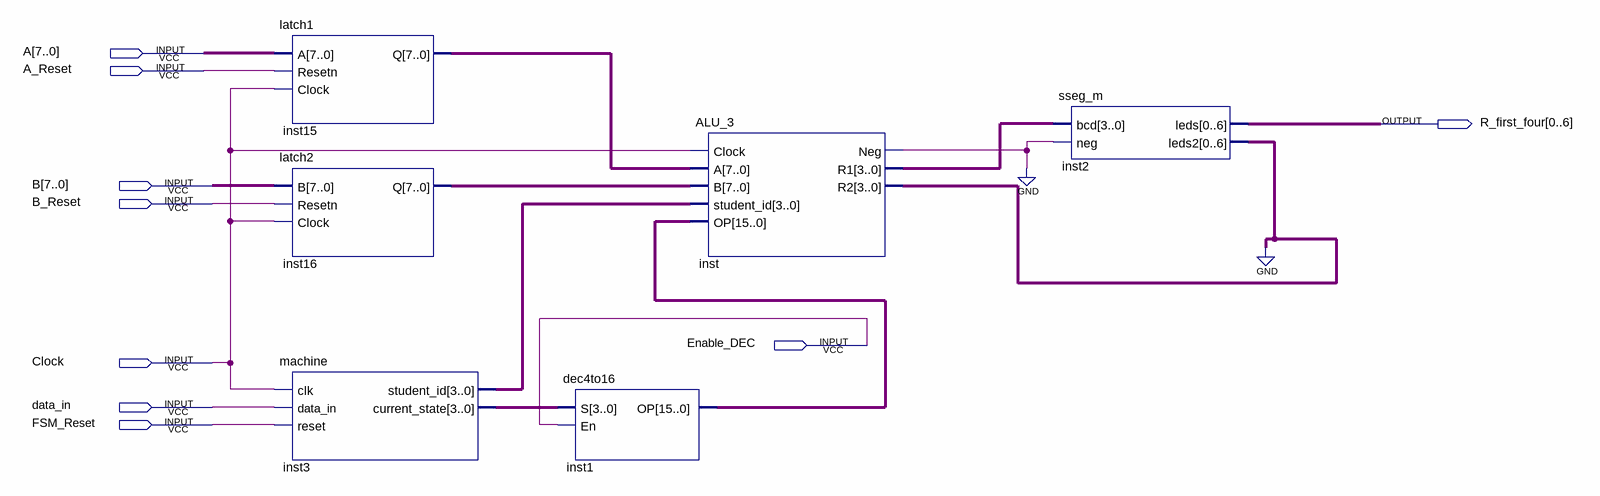
[diagram p0: schematic sheet]
// Quartus schematic alu_3gpu.bdf as structural Verilog: 6 symbols, 9 pins
module alu_3gpu (
  input  [7:0] A,
  input  A_Reset,
  input  [7:0] B,
  input  B_Reset,
  input  Enable_DEC,
  input  Clock,
  input  data_in,
  input  FSM_Reset,
  output [0:6] R_first_four
);

  wire inst_neg;
  wire [3:0] inst3_current_state, inst3_student_id, inst_r1;
  wire [6:0] inst_r2;
  wire [7:0] inst15_q, inst16_q;
  wire [15:0] inst1_op;

  latch1 inst15 (.A(A), .Resetn(A_Reset), .Clock(Clock), .Q(inst15_q));
  latch2 inst16 (.B(B), .Resetn(B_Reset), .Clock(Clock), .Q(inst16_q));
  machine inst3 (
    .clk(Clock), .data_in(data_in), .reset(FSM_Reset), .student_id(inst3_student_id),
    .current_state(inst3_current_state));
  dec4to16 inst1 (.S(inst3_current_state), .En(Enable_DEC), .OP(inst1_op));
  ALU_3 inst (
    .Clock(Clock), .A(inst15_q), .B(inst16_q), .student_id(inst3_student_id), .OP(inst1_op), .Neg(inst_neg),
    .R1(inst_r1), .R2(inst_r2));
  sseg_m inst2 (.bcd(inst_r1), .neg(inst_neg), .leds(R_first_four), .leds2(inst_r2));
  // also tied to GND on the sheet: {inst_r2[0], inst_r2[1], inst_r2[2], inst_r2[3], inst_r2[4], inst_r2[5], inst_r2[6], inst_neg}
endmodule
